# Altium schematic sheet switch_mode.SchDoc
size A4; SheetNumber: 1; SheetTotal: 1
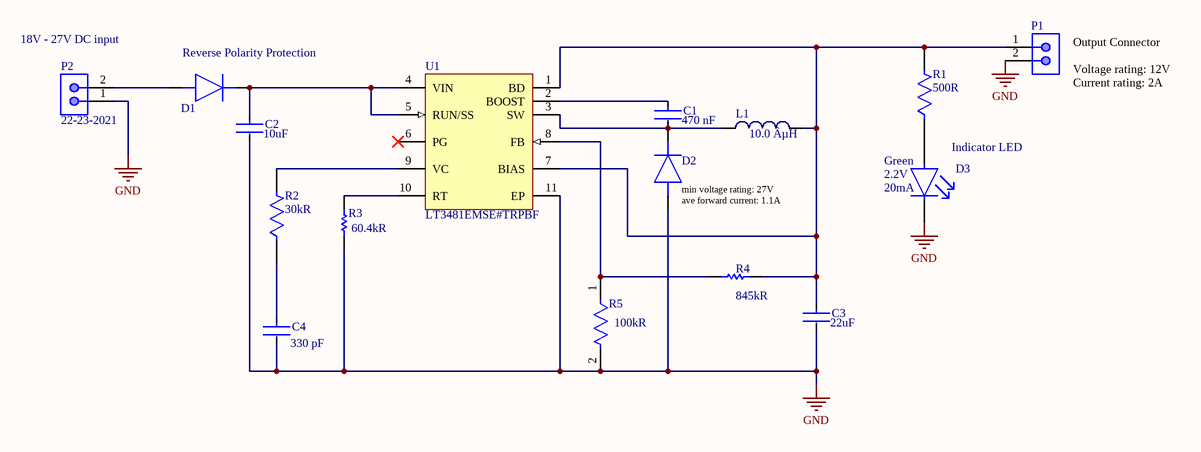
[diagram p0: switch_mode.SchDoc]

## Parts
C1  value 470 nF  [FP-CC0805-0_85-MFG]  (hidden comment: CC0805KKX7R7BB474)
C2  Capacitance: 10uF  [FP-GRM31-0_2-MFG]  (hidden comment: GRM31CR61H106KA12L)
C3  Capacitance: 22uF  [FP-GRM31C-0_2-e0_3_0_8-MFG]  (hidden comment: GRM31CR71A226KE15L)
C4  Capacitance: 330 pF  [FP-CC1206-1_25-MFG]  (hidden comment: CC1206KRX7R9BB331)
D1  B230-13-F  [DIONM5336X250N]  (value not drawn)
D2  B230-13-F  [DIONM5336X250N]  (value not drawn)
D3  Forward Current: 20mA  Forward Voltage: 2.2V  Colour: Green  [FP-597-3301-507F-MFG]  (hidden comment: 597-3301-507F)
L1  Inductance: 10.0 ÂµH  [WE-LQS 6045]  (hidden comment: 74404064100)
P1  22-23-2021  [MOLX-22-23-2021_V]  (value not drawn)
P2  22-23-2021  [MOLX-22-23-2021_V]
R1  Resistance: 500R  [FP-MCA1206-IPC_C]  (hidden comment: MCA12060D5000BP500)
R2  Resistance: 30kR  [FP-CRCW0805-e3-MFG]  (hidden comment: CRCW080530K0FKEA)
R3  Resistance: 60.4kR  [RESC2013X50X30ML20T20]  (hidden comment: CRCW080560K4FKEA)
R4  Resistance: 845kR  [RESC2013X50X30LL20T20]  (hidden comment: CRCW0805845KFKEA)
R5  Resistance: 100kR  [FP-CRCW0805-e3-MFG]  (hidden comment: CRCW0805100KFKEA)
U1  LT3481EMSE#TRPBF  [LT-MSE-10-EDP-2060x1830TP_M]

## Nets
GND: C2.2 C3.2 C4.2 D2.1(A) D3.1(C) P1.2 P2.1 R3.1 R5.2 U1.11(EP)
NetC1_1: C1.1 U1.2(BOOST)
NetC1_2: C1.2 D2.2(K) L1.1 U1.3(SW)
NetC2_1: C2.1 D1.2(K) U1.4(VIN) U1.5(RUN/SS)
NetC3_1: C3.1 L1.2 P1.1 R1.2 R4.1 U1.1(BD) U1.7(BIAS)
NetC4_1: C4.1 R2.1
NetD1_1: D1.1(A) P2.2
NetD3_2: D3.2(A) R1.1
NetR2_2: R2.2 U1.9(VC)
NetR3_2: R3.2 U1.10(RT)
NetR4_2: R4.2 R5.1 U1.8(FB)

Not connected (* = marked no-connect by the designer): U1 6(PG)*

## Notes on the sheet
- (near P2) 18V - 27V DC input
- (near D1) Reverse Polarity Protection
- (near P1) Output Connector
  Voltage rating: 12V
  Current rating: 2A
- Indicator LED
- (near D2) min voltage rating: 27V
  ave forward current: 1.1A

## Library data of the parts
C1 = CMP-03422-000080-1: CAP CER 0.47UF 16V X7R 0805; Manufacturer: Yageo; Material: Ceramic; Tolerance: 0.1; Ipc Land Pattern Name: CAPC200125X85; Height: 0.95mm; ComponentLink2Description: Datasheet; Mouser Description: 0805 0.47 uF 16 V ±10% Tolerance X7R SMT Multilayer Ceramic Capacitor; Temperature Characteristic: X7R; Lead Free: Yes; Temperature: -30°C to +85°C; Automotive: No; Digikey Description: CAP CER 0.47UF 16V X7R 0805; RoHS: TRUE; Capacitance: 470 nF; Octopart: https://octopart.com/cc0805kkx7r7bb474-yageo-42522863; Temperature Range High: +85°C; Footprint Url: http://www.yageo.com/exep/pages/download/literatures/UPY-C_GEN_24.pdf; Manufacturer Part Number: CC0805KKX7R7BB474; Device Class L3: Ceramic Capacitors; Package: CC0805-0.85; Device Class L2: Capacitors; Voltage Rating: 16 V; Category: Cap; Device Class L1: Passive Components; ComponentLink2URL: http://www.yageo.com/documents/recent/UPY-GPHC_Y5V_6.3V-to-50V_8.pdf; Temperature Range Low: -30°C
C2 = CMP-2000-05256-2: CAP CER 10UF 50V X5R 1206; Manufacturer: Murata Electronics North America; Tolerance: 10%; Temperature Coefficient: 15%; Material: Ceramic; Height: 1.8mm; Temperature: -55°C to +85°C; Lead Free: Yes; Temperature Characteristic: X5R; ComponentLink2Description: Datasheet; Digikey Description: CAP CER 10UF 50V X5R 1206; Octopart: https://octopart.com/grm31cr61h106ka12l-murata-18903335; Device Class L2: Capacitors; Automotive: No; Value: 10uF; Temperature Range High: +85°C; Temperature Range Low: -55°C; Device Class L3: Ceramic Capacitors; Voltage Rating: 50V; Device Class L1: Passive Components; Mouser Description: Multilayer Ceramic Capacitors MLCC - SMD/SMT 1206 10uF 50volt X5R +/-10%; ComponentLink2URL: https://search.murata.co.jp/Ceramy/image/img/A01X/G101/ENG/GRM31CR61H106KA12-01A.pdf; Manufacturer Part Number: GRM31CR61H106KA12L; Package: GRM31-0.2; RoHS: TRUE; Category: Cap
C3 = CMP-06035-003841-1: Chip Multilayer Ceramic Capacitors for General Purpose, 1206, 22uF, X7R, 15%, 10%, 10V; Height: 1.6mm; Width: 0.063inch; Min Operating Temperature: -55°C; Package Quantity: 1; Termination: SMD/SMT; Length: 3.2mm; Voltage Rating: 10V; Case/Package: 1206; Case Code (Imperial): 1206; Depth: 1.6mm; Dielectric: X7R; Voltage: 10V; Material: Ceramic; Tolerance: 10%; Voltage Rating (DC): 10V; Lead Free: Lead Free; Max Operating Temperature: 125°C; Case Code (Metric): 3216; Packaging: Tape and Reel; Thickness: 0.071inch; Radiation Hardening: No; REACH SVHC: No SVHC; Mount: Surface Mount
C4 = CMP-03422-000307-1: CAP CER 330PF 50V X7R 1206; Manufacturer: Yageo; Material: Ceramic; Temperature Coefficient: 15%; Tolerance: 0.1; Automotive Grade: NA; ComponentLink2URL: http://www.yageo.com/documents/recent/UPY-NP0X7R_HV_1KV-to-3KV_11.pdf; RoHS: TRUE; Automotive: No; Temperature Characteristic: X7R; Package: CC1206-1.25; Footprint Url: http://www.yageo.com/exep/pages/download/literatures/UPY-C_GEN_24.pdf; Temperature Range High: +125°C; Device Class L3: Ceramic Capacitors; Temperature Range Low: -55°C; Lead Free: Yes; Device Class L1: Passive Components; Octopart: https://octopart.com/cc1206krx7r9bb331-yageo-193019; Height: 1.45mm; Mouser Description: 1206 330 pF 50 V ±10 % Tolerance X7R SMT Multilayer Ceramic Capacitor; Manufacturer Part Number: CC1206KRX7R9BB331; Value: 330 pF; Device Class L2: Capacitors; Temperature: -55°C to +125°C; Digikey Description: CAP CER 330PF 50V X7R 1206; ComponentLink2Description: Datasheet; Voltage Rating: 50 V; Category: Cap
D1 D2 = B230-13-F: Diode; Manufacturer_Name: Diodes Inc.; Datasheet Link: https://componentsearchengine.com/Datasheets/2/B230-13-F.pdf; Height: 2.5mm; Manufacturer_Part_Number: B230-13-F; Mouser Part Number: 621-B230-F; Mouser Price/Stock: https://www.mouser.co.uk/ProductDetail/Diodes-Incorporated/B230-13-F?qs=vC9GXGO01wXQLD6VVDHa%2Fw%3D%3D; Arrow Part Number: B230-13-F; Arrow Price/Stock: https://www.arrow.com/en/products/b230-13-f/diodes-incorporated
D3 = CMP-15384-000001-1: LED GREEN CLEAR 1208 SMD; Manufacturer: Dialight; Wavelength: 573nm; Luminous Intensity: 25mcd; Led Orientation: Top View; Power Dissipation: 70mW; Viewing Angle: 110°; Peak Emmision Wavelength: 570nm; RoHS: TRUE; Temperature Range High: +85°C; Octopart: https://octopart.com/597-3301-507f-dialight-117926; Device Class L3: unset; Device Class L1: Optoelectronics; Automotive: No; Lead Free: Yes; Manufacturer Part Number: 597-3301-507F; Height: 1.5mm; ComponentLink2Description: Datasheet; Temperature Range Low: -30°C; Mouser Description: Standard LEDs - SMD Green 563nm 16mcd 2.2V 104 deg; Device Class L2: LEDs; Temperature: -30°C to +85°C; Package: 597-3301-507F; ComponentLink2URL: http://www.dialightsignalsandcomponents.com/Assets/Drawings/2D_Drawings_DrawingDetailedSpec/C17290.pdf; Category: Diode; Digikey Description: LED GREEN CLEAR 1208 SMD
L1 = CMP-1354-00072-1: WE-LQS SMD Power Inductor, L=10.0 µH; Manufacturer: Wuerth Elektronik; ComponentLink2URL: http://katalog.we-online.de/pbs/datasheet/74404064100.pdf; ComponentLink1Description: Manufacturer URL; PartNumber: 74404064100; ComponentLink2Description: Datasheet; ComponentLink1URL: http://www.we-online.com; PackageReference: WE-LQS 6045
P1 P2 = CMP-1704-00001-3: Male Header, Pitch 2.54 mm, 1 x 2 Position, Height 10.67 mm, Tail Length 3.56 mm, 0 to 75 degC, RoHS, Bulk; Package Quantity: 3000; Height: 10.67 mm; RoHSCompliant: True; ComponentLink2URL: https://datasheet.ciiva.com/19454/232266-19454304.pdf; PartNumber: 22-23-2021; Packaging: Bulk; ComponentLink2Description: Datasheet; Min Operating Temperature: 0 degC; ComponentLink1Description: Manufacturer URL; Length: 5.08 mm; Mounting Technology: Through Hole; Max Operating Temperature: 75 degC; REACH SVHC: Unknown; PackageDescription: Male Header, Pitch 2.54 mm, 1 x 2 Position, Height 10.67 mm, Tail Length 3.56 mm; ComponentLink1URL: http://www.molex.com/; Mount: Through Hole; Radiation Hardening: No; Width: 6.35 mm; Pins: 2
R1 = CMP-02407-005036-1: Res MC Precision Thin Film 1206 500Ω 0.1% 0.25W ±25ppm/°C Molded Paper T/R; Max Power Dissipation: 250mW; Min Operating Temperature: -55°C; Length: 0.126inch; Packaging: Tape and Reel; Composition: Thin Film; Width: 0.063inch; Height: 0.026inch; Package Quantity: 5000; Number of Terminations: 2; Lead Free: Lead Free; Temperature Coefficient: 25ppm/°C; Case/Package: 1206; Max Operating Temperature: 125°C; Tolerance: 0.1%; Depth: 1.6mm; Military Standard: Not
R2 = CMP-2001-03804-2: RES Thick Film, 30kΩ, 1%, 0.125W, 100ppm/°C, 0805; Max Power Dissipation: 125mW; Voltage Rating (DC): 150V; Contact Plating: Tin; Weight: 0.000194oz; Temperature Coefficient: 100ppm/°C; Packaging: Tape and Reel; Height: 0.45mm; Case Code (Imperial): 0805; Max Operating Temperature: 155°C; Case/Package: 0805; Package Quantity: 10; Case Code (Metric): 2012; Features: Automotive AEC-Q200; Mount: Surface Mount; Length: 2mm; Termination: SMD/SMT; Lead Free: Lead Free; Width: 0.049inch; Number of Pins: 2; Depth: 1.25mm; Min Operating Temperature: -55°C; Power Rating: 125mW; Voltage Rating: 150V; Military Standard: Not; Composition: Thick Film; Tolerance: 1%; Number of Terminations: 2; Radiation Hardening: No
R3 = CMP-2001-04043-1: Manufacturer: Vishay Dale; Part Number: CRCW080560K4FKEA
R4 = CMP-2001-04139-1: Manufacturer: Vishay Dale; Part Number: CRCW0805845KFKEA
R5 = CMP-2001-04899-2: RES Thick Film, 100kΩ, 1%, 0.125W, 100ppm/°C, 0805; Power Rating: 125mW; Voltage Rating: 150V; Case/Package: 0805; Max Operating Temperature: 155°C; Case Code (Imperial): 0805; Lead Free: Lead Free; Weight: 0.000194oz; Number of Pins: 2; Package Quantity: 5000; Height: 0.45mm; Composition: Thick Film; Military Standard: Not; Tolerance: 1%; Case Code (Metric): 2012; Termination: SMD/SMT; Mount: Surface Mount; Radiation Hardening: No; Width: 1.25mm; Length: 2mm; Depth: 1.25mm; Packaging: Tape and Reel; Min Operating Temperature: -55°C; Contact Plating: Tin; Temperature Coefficient: 100ppm/°C; Voltage Rating (DC): 150V
U1 = CMP-0491-01083-1: 2 A, 2.8 MHz Step-Down Switching Regulator with 50 uA Quiescent Current, 10-pin SOP (MSE-10-EDP), -40 to 85 degC, Pb-Free, Tape and Reel; Manufacturer: Linear Technology; Frequency Sync Range: 275kHz - 475kHz; Number of Outputs: 1; PartNumber: LT3481EMSE#TRPBF; ComponentLink3Description: Package Specification; PackageReference: MSE-10; ComponentLink2URL: http://cds.linear.com/docs/en/datasheet/3481fc.pdf; ComponentLink2Description: Datasheet; PackageDescription: 10-Pin Plastic MSOP, Exposed Die Pad, Body 3 x 3 mm, Pitch 0.5 mm; ComponentLink1Description: Manufacturer URL; PackageVersion: Rev. C, 08/2009; Mounting Technology: Surface Mount; RoHS: TRUE; Packing: Tape and Reel; ComponentLink1URL: http://www.linear.com/; DatasheetVersion: Rev. C; ComponentLink3URL: http://cds.linear.com/docs/en/datasheet/3481fc.pdf